# Altium schematic sheet SS34F_C9086691_SS34F_C908669.schdoc
size 127 x 101 mm
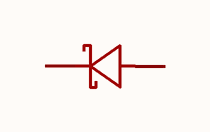
[diagram p0: SS34F_C9086691_SS34F_C908669.schdoc]

## Parts
D?  SS34F  [SMAF_L3.5-W2.6-LS4.7-FD]  (value not drawn)

## Nets

Not connected (* = marked no-connect by the designer): D? 1(A) 2(K)

## Library data of the parts
D? = SS34F_C908669: Manufacturer: GOODWORK(固得沃克); Add into BOM: yes; Diode Configuration: 独立式; Forward Voltage (Vf@If): 550mV@3A; Reverse Voltage (Vr): 40V; Average Rectified Current (Io): 3A; Reverse Leakage Current (Ir): 200uA@40V; Symbol: SS34F_C908669; Device: SS34F_C908669; LCSC Part Name: 电压:40V 电流:3A; Supplier Part: C908669; Manufacturer Part: SS34F; Supplier Footprint: SMAF; JLCPCB Part Class: Extended Part; Datasheet: https://atta.szlcsc.com/upload/public/pdf/source/20201231/C908669_14F884D2643FB3EE455C9EAA3A20B275.pdf; Supplier: LCSC; Convert to PCB: yes